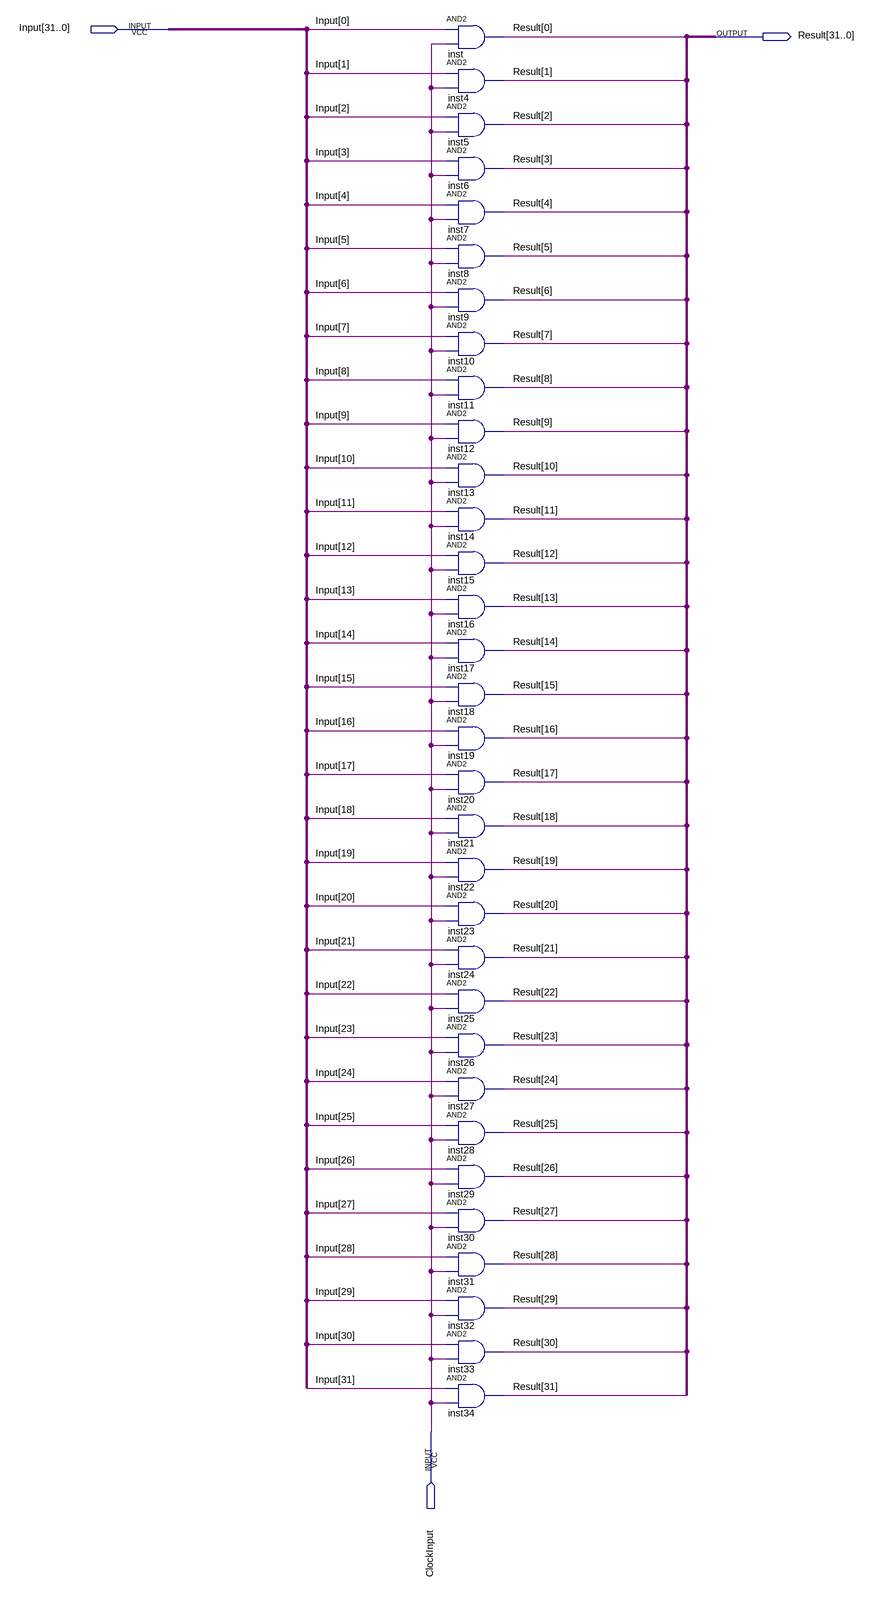
[diagram p0: schematic sheet]
// Quartus schematic programcounter.bdf as structural Verilog: 32 symbols, 3 pins
module programcounter (
  input  [31:0] Input,
  input  ClockInput,
  output [31:0] Result
);

  and inst (Result[0], Input[0], ClockInput);
  and inst4 (Result[1], Input[1], ClockInput);
  and inst5 (Result[2], Input[2], ClockInput);
  and inst6 (Result[3], Input[3], ClockInput);
  and inst7 (Result[4], Input[4], ClockInput);
  and inst8 (Result[5], Input[5], ClockInput);
  and inst9 (Result[6], Input[6], ClockInput);
  and inst10 (Result[7], Input[7], ClockInput);
  and inst11 (Result[8], Input[8], ClockInput);
  and inst12 (Result[9], Input[9], ClockInput);
  and inst13 (Result[10], Input[10], ClockInput);
  and inst14 (Result[11], Input[11], ClockInput);
  and inst15 (Result[12], Input[12], ClockInput);
  and inst16 (Result[13], Input[13], ClockInput);
  and inst17 (Result[14], Input[14], ClockInput);
  and inst18 (Result[15], Input[15], ClockInput);
  and inst19 (Result[16], Input[16], ClockInput);
  and inst20 (Result[17], Input[17], ClockInput);
  and inst21 (Result[18], Input[18], ClockInput);
  and inst22 (Result[19], Input[19], ClockInput);
  and inst23 (Result[20], Input[20], ClockInput);
  and inst24 (Result[21], Input[21], ClockInput);
  and inst25 (Result[22], Input[22], ClockInput);
  and inst26 (Result[23], Input[23], ClockInput);
  and inst27 (Result[24], Input[24], ClockInput);
  and inst28 (Result[25], Input[25], ClockInput);
  and inst29 (Result[26], Input[26], ClockInput);
  and inst30 (Result[27], Input[27], ClockInput);
  and inst31 (Result[28], Input[28], ClockInput);
  and inst32 (Result[29], Input[29], ClockInput);
  and inst33 (Result[30], Input[30], ClockInput);
  and inst34 (Result[31], Input[31], ClockInput);
endmodule
